# EAGLE schematic arduino_uno_to_attiny_x313 (EAGLE 9.2.2)
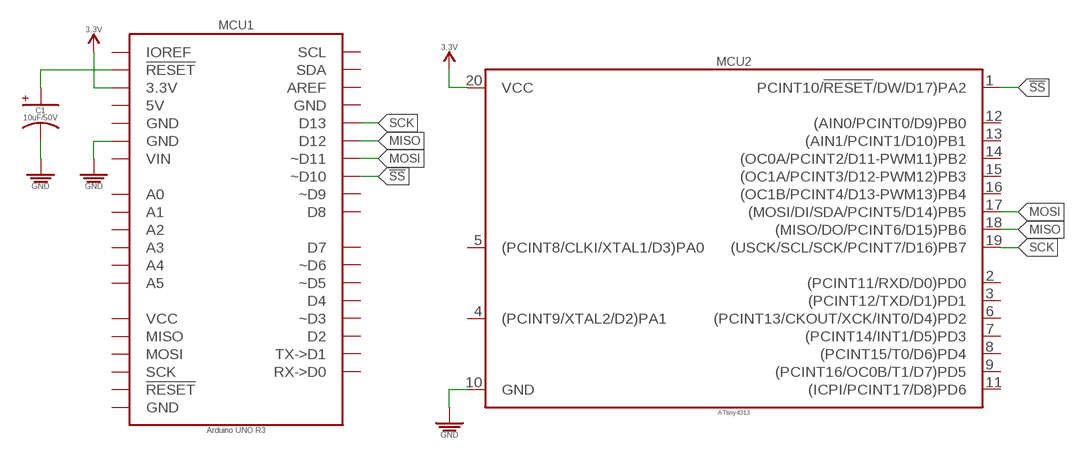
[diagram p0: schematic, sheet 1]

## Parts
C1  10uF/50V  10UF-POLARIZED_PTH_50V-20%  [_AE_PTH-DIA5-LS2-H5]
MCU1  Arduino UNO R3  ARDUINO_UNO_R3  [ARDUINO_UNO_R3]
MCU2  ATtiny4313  ATTINY-X313_DIP-20_ATTINY-4313  [DIP793W45P254L2573H533Q20B_DIP-20_ATTINY-X313]

## Nets
3.3V: MCU1.3.3V MCU2.20(VCC)
!SS: MCU1.D10(~D10) MCU2.1(PCINT10/!RESET!/DW/D17)PA2)
GND: C1.-(K) MCU1.GND@3(GND) MCU2.10(GND)
MISO: MCU1.D12 MCU2.18((MISO/DO/PCINT6/D15)PB6)
MOSI: MCU1.D11(~D11) MCU2.17((MOSI/DI/SDA/PCINT5/D14)PB5)
N$1: C1.+(A) MCU1.RESET@1(!RESET!)
SCK: MCU1.D13 MCU2.19((USCK/SCL/SCK/PCINT7/D16)PB7)
Unconnected: MCU1.5V MCU1.A0 MCU1.A1 MCU1.A2 MCU1.A3 MCU1.A4 MCU1.A5 MCU1.AREF MCU1.D0(RX->D0) MCU1.D1(TX->D1) MCU1.D2 MCU1.D3(~D3) MCU1.D4 MCU1.D5(~D5) MCU1.D6(~D6) MCU1.D7 MCU1.D8 MCU1.D9(~D9) MCU1.GND@1(GND) MCU1.GND@2(GND) MCU1.GND@4(GND) MCU1.IOREF MCU1.MISO MCU1.MOSI MCU1.RESET@2(!RESET!) MCU1.SCK MCU1.SCL MCU1.SDA MCU1.VCC MCU1.VIN MCU2.2((PCINT11/RXD/D0)PD0) MCU2.3((PCINT12/TXD/D1)PD1) MCU2.4((PCINT9/XTAL2/D2)PA1) MCU2.5((PCINT8/CLKI/XTAL1/D3)PA0) MCU2.6((PCINT13/CKOUT/XCK/INT0/D4)PD2) MCU2.7((PCINT14/INT1/D5)PD3) MCU2.8((PCINT15/T0/D6)PD4) MCU2.9((PCINT16/OC0B/T1/D7)PD5) MCU2.11((ICPI/PCINT17/D8)PD6) MCU2.12((AIN0/PCINT0/D9)PB0) MCU2.13((AIN1/PCINT1/D10)PB1) MCU2.14((OC0A/PCINT2/D11-PWM11)PB2) MCU2.15((OC1A/PCINT3/D12-PWM12)PB3) MCU2.16((OC1B/PCINT4/D13-PWM13)PB4)

## Library data of the parts
C1 = PiB_capacitors:10UF-POLARIZED; DATASHEET: https://industrial.panasonic.com/cdbs/www-data/pdf/RDF0000/ABA0000C1050.pdf; DIST: Digikey; DISTLINK: https://www.digikey.com/products/en/capacitors/aluminum-electrolytic-capacitors/58?k=P828-ND; DISTPN: P828-ND; MFR: Panasonic Electronic Components; MPN: ECE-A1HKA100
MCU1 = PiB_boards:ARDUINO_UNO_R3; DATASHEET: https://media.digikey.com/pdf/Data%20Sheets/Arduino%20PDFs/A000066_Web.pdf; DATASHEET_CABLE: http://www.assmann-wsw.com/fileadmin/datasheets/ASS_7066_CA.pdf; DIST: Digikey; DISTLINK: https://www.digikey.com/products/en?keywords=1050-1024-ND; DISTLINK_CABLE: https://www.digikey.com/products/en?keywords=AE1462-ND; DISTPN: 1050-1024-ND; DISTPN_CABLE: AE1462-ND; DIST_CABLE: Digikey; MFR: Arduino; MFR_CABLE: Assmann WSW Components; MPN: A000066; MPN_CABLE: AK672/2-1
MCU2 = PiB_ic_microcontrollers:ATTINY-X313; DATASHEET: http://www.microchip.com/mymicrochip/filehandler.aspx?ddocname=en590457; DIST: Digikey; DISTLINK: https://www.digikey.com/products/en?keywords=ATTINY4313-PU-ND; DISTPN: ATTINY4313-PU-ND; MFR: Microchip Technology; MPN: ATTINY4313-PU